# Altium schematic sheet Farm_Pump.SchDoc
size A4; SheetNumber: 1; SheetTotal: 13
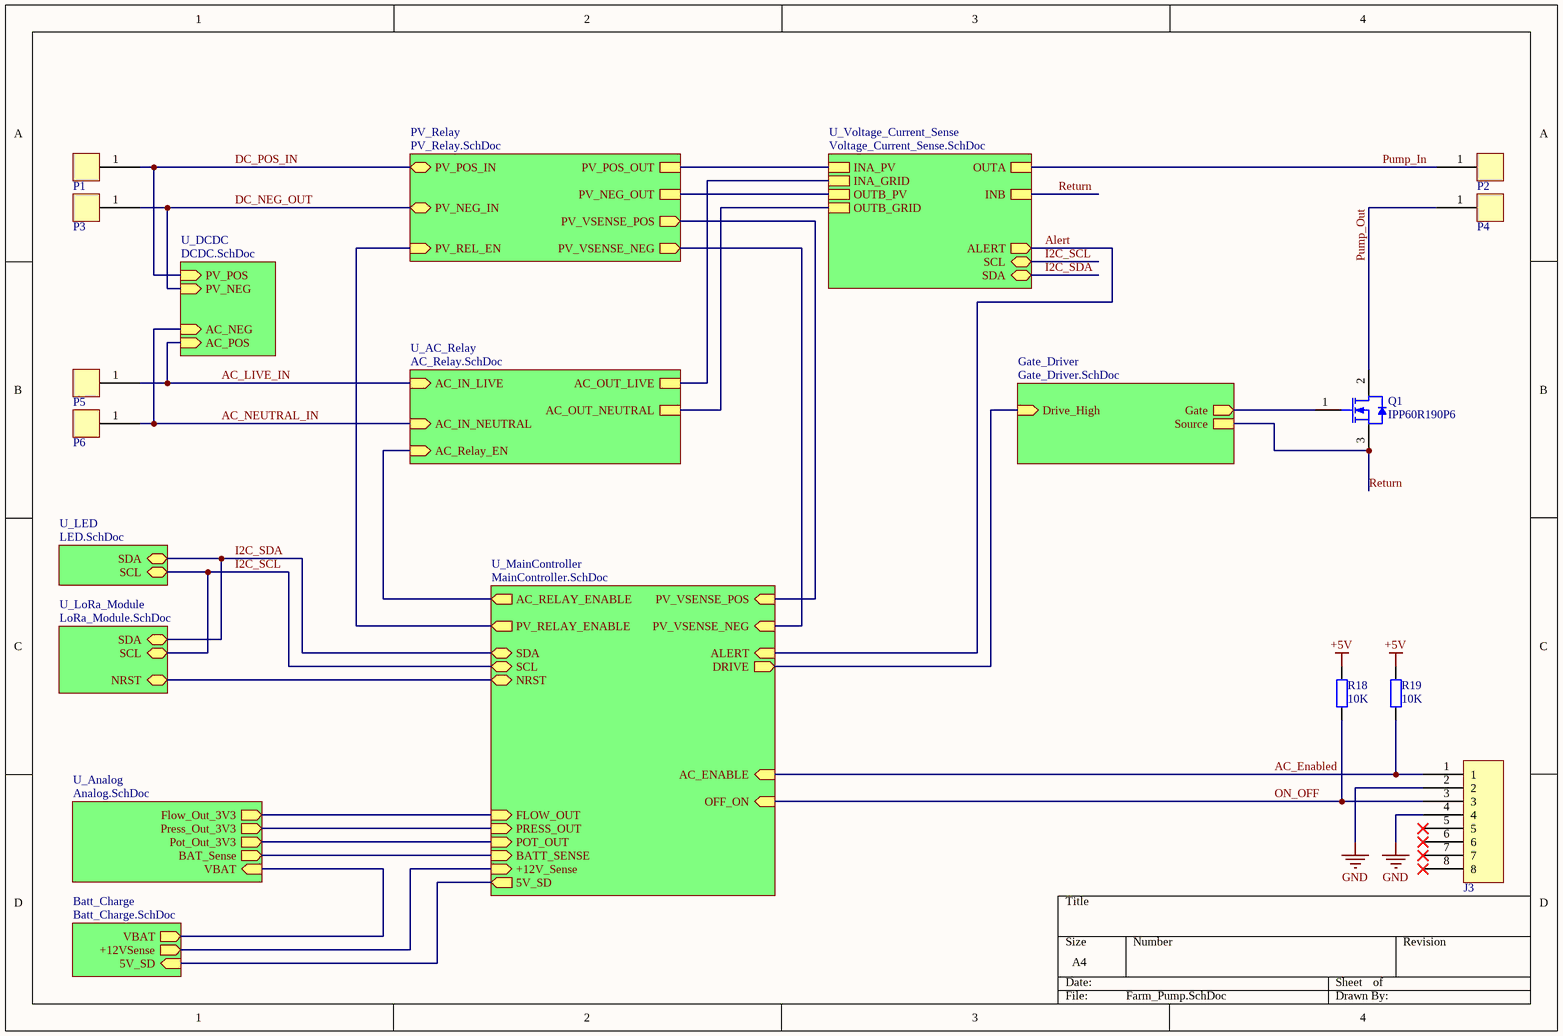
[diagram p0: Farm_Pump.SchDoc]

## Parts
J3  MTJ-885X1  [MTJ-885X1]  (value not drawn)
P1  1719189  [1719189]  (value not drawn)
P2  1719189  [1719189]  (value not drawn)
P3  1719189  [1719189]  (value not drawn)
P4  1719189  [1719189]  (value not drawn)
P5  1719189  [1719189]  (value not drawn)
P6  1719189  [1719189]  (value not drawn)
Q1  IPP60R190P6  [INF-PG-TO220-3-1_A_V]
R18  10K  [RES 0603/1608]
R19  10K  [RES 0603/1608]

## Sub-sheets
Batt_Charge = Batt_Charge.SchDoc: VBAT (out), 5V_SD (in), +12VSense (out)
Gate_Driver = Gate_Driver.SchDoc: Drive_High (in), Gate (out), Source
PV_Relay = PV_Relay.SchDoc: PV_POS_IN (bidir), PV_NEG_IN (bidir), PV_VSENSE_POS (out), PV_POS_OUT, PV_VSENSE_NEG (out), PV_REL_EN (in), PV_NEG_OUT
U_AC_Relay = AC_Relay.SchDoc: AC_IN_LIVE (in), AC_IN_NEUTRAL (in), AC_Relay_EN (in), AC_OUT_LIVE, AC_OUT_NEUTRAL
U_Analog = Analog.SchDoc: Flow_Out_3V3 (out), Press_Out_3V3 (out), Pot_Out_3V3 (out), VBAT (in), BAT_Sense (out)
U_DCDC = DCDC.SchDoc: AC_POS (in), AC_NEG (in), PV_POS (in), PV_NEG (in)
U_LED = LED.SchDoc: SCL (bidir), SDA (bidir)
U_LoRa_Module = LoRa_Module.SchDoc: SCL (bidir), SDA (bidir), NRST (bidir)
U_MainController = MainController.SchDoc: PV_VSENSE_POS (in), PV_VSENSE_NEG (in), PV_RELAY_ENABLE (out), AC_RELAY_ENABLE (out), DRIVE (out), OFF_ON (in), AC_ENABLE (in), FLOW_OUT (in), PRESS_OUT (in), POT_OUT (in), BATT_SENSE (in), SCL (bidir), ALERT (in), SDA (bidir), 5V_SD (out), NRST (bidir), +12V_Sense (in)
U_Voltage_Current_Sense = Voltage_Current_Sense.SchDoc: INA_PV, OUTA, INB, OUTB_PV, ALERT (out), SCL (bidir), SDA (bidir), OUTB_GRID, INA_GRID

## Nets
+5V: R18.2 R19.2
GND: J3.2 J3.4
AC_Enabled: J3.1 R19.1 ; sheet U_MainController/AC_ENABLE
AC_LIVE_IN: P5.1 ; sheet U_AC_Relay/AC_IN_LIVE, sheet U_DCDC/AC_POS
AC_NEUTRAL_IN: P6.1 ; sheet U_AC_Relay/AC_IN_NEUTRAL, sheet U_DCDC/AC_NEG
Alert: sheet U_Voltage_Current_Sense/ALERT, sheet U_MainController/ALERT
DC_NEG_OUT: P3.1 ; sheet PV_Relay/PV_NEG_IN, sheet U_DCDC/PV_NEG
DC_POS_IN: P1.1 ; sheet PV_Relay/PV_POS_IN, sheet U_DCDC/PV_POS
I2C_SCL: sheet U_Voltage_Current_Sense/SCL, sheet U_LED/SCL, sheet U_LoRa_Module/SCL, sheet U_MainController/SCL
I2C_SDA: sheet U_Voltage_Current_Sense/SDA, sheet U_LED/SDA, sheet U_LoRa_Module/SDA, sheet U_MainController/SDA
ON_OFF: J3.3 R18.1 ; sheet U_MainController/OFF_ON
Pump_In: P2.1 ; sheet U_Voltage_Current_Sense/OUTA
Pump_Out: P4.1 Q1.2(DRAIN)
Return: Q1.3(SOURCE) ; sheet Gate_Driver/Source, sheet U_Voltage_Current_Sense/INB
NetQ1_1: Q1.1(GATE) ; sheet Gate_Driver/Gate
(unnamed): sheet Gate_Driver/Drive_High, sheet U_MainController/DRIVE
(unnamed): sheet PV_Relay/PV_VSENSE_POS, sheet U_MainController/PV_VSENSE_POS
(unnamed): sheet PV_Relay/PV_POS_OUT, sheet U_Voltage_Current_Sense/INA_PV
(unnamed): sheet PV_Relay/PV_VSENSE_NEG, sheet U_MainController/PV_VSENSE_NEG
(unnamed): sheet PV_Relay/PV_REL_EN, sheet U_MainController/PV_RELAY_ENABLE
(unnamed): sheet PV_Relay/PV_NEG_OUT, sheet U_Voltage_Current_Sense/OUTB_PV
(unnamed): sheet Batt_Charge/VBAT, sheet U_Analog/VBAT
(unnamed): sheet Batt_Charge/5V_SD, sheet U_MainController/5V_SD
(unnamed): sheet Batt_Charge/+12VSense, sheet U_MainController/+12V_Sense
(unnamed): sheet U_AC_Relay/AC_Relay_EN, sheet U_MainController/AC_RELAY_ENABLE
(unnamed): sheet U_AC_Relay/AC_OUT_LIVE, sheet U_Voltage_Current_Sense/INA_GRID
(unnamed): sheet U_AC_Relay/AC_OUT_NEUTRAL, sheet U_Voltage_Current_Sense/OUTB_GRID
(unnamed): sheet U_Analog/Flow_Out_3V3, sheet U_MainController/FLOW_OUT
(unnamed): sheet U_Analog/Press_Out_3V3, sheet U_MainController/PRESS_OUT
(unnamed): sheet U_Analog/Pot_Out_3V3, sheet U_MainController/POT_OUT
(unnamed): sheet U_Analog/BAT_Sense, sheet U_MainController/BATT_SENSE
(unnamed): sheet U_LoRa_Module/NRST, sheet U_MainController/NRST

Not connected (* = marked no-connect by the designer): J3 5* 6* 7* 8*

## Library data of the parts
J3 = MTJ-885X1: manufacturer: MODULAR JACK RJ45 8P8C; inventory_price: 0.97; partnumber: MTJ-885X1; Manufacturer Part Number: MTJ-885X1; URL Datasheet: https://app.adam-tech.com/products/download/data_sheet/203809/mtj-885x1-data-sheet.pdf; Digikey PN: 2057-MTJ-885X1-ND; parttype: Modular Connectors - Jacks
P1-P6 = 1719189: manufacturer: Phoenix Contact; Current: 41; Voltage: 1000; inventory_price: 3.143; partnumber: 1719189; Manufacturer Part Number: 1719189; URL Datasheet: https://docs.rs-online.com/3ee6/0900766b813ab54c.pdf; parttype: PCB Terminal Blocks
Q1 = CMP-1164-00090-1: N-Channel CoolMOS(TM) P6 Power Transistor, 600 V VDS, -55 to 150 degC, PG-TO220-3, Tube, Green; Manufacturer: Infineon; RDS (on) (max): 190 mOhm; VDS (max): 600 V; Green: TRUE; Polarity: FALSE; Halogen-free: TRUE; Packing: Tube; Mounting Technology: Through Hole; ComponentLink1Description: Manufacturer URL; ComponentLink3URL: http://www.infineon.com/dgdl/IKP30N65H5_2_1.pdf?folderId=db3a3043156fd5730115f56849b61941&fileId=5546d461464245d30146a51a2ca36d28; DatasheetVersion: Rev. 2.1; ComponentLink3Description: Package Specification; ComponentLink2Description: Datasheet; PackageReference: PG-TO220-3-1_A; ComponentLink2URL: http://www.infineon.com/dgdl/DS_IPx60R190P6_2_1.pdf?folderId=db3a3043156fd5730115c736bcc70ff2&fileId=db3a30433f2e70c5013f37c80e24240f; PartNumber: IPP60R190P6; PackageVersion: Rev. 05, 08/2007; PackageDescription: 3-Pin Plastic (Green) Transistor Single Outline Package, 10.03 x 8.98 mm Body, 2.54 mm Pitch; ComponentLink1URL: http://www.infineon.com/
R18 R19 = RG1608P-103-B-T5: RES SMD 10K OHM 0.1% 1/10W 0603; Manufacturer: Susumu; Package Imperial: 0603; Package Metric: 1608; Part Number: RG1608P-103-B-T5; Value: 10K; Tolerance: 0.1%; Digi-Key Part Number: RG16P10.0KBCT-ND